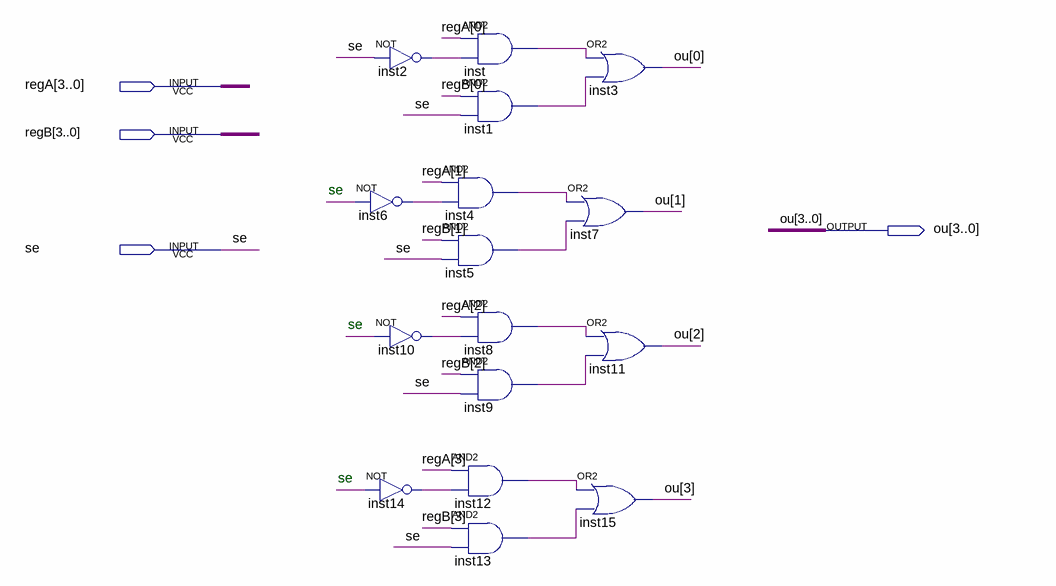
[diagram p0: schematic sheet]
// Quartus schematic mux2.bdf as structural Verilog: 16 symbols, 4 pins
module mux2 (
  input  [3:0] regA,
  input  [3:0] regB,
  input  se,
  output [3:0] ou
);

  wire inst1_out, inst2_out, inst4_out, inst5_out, inst6_out, inst8_out, inst9_out, inst10_out, inst12_out,
       inst13_out, inst14_out, inst_out;

  not inst2 (inst2_out, se);
  not inst6 (inst6_out, se);
  not inst10 (inst10_out, se);
  not inst14 (inst14_out, se);
  and inst (inst_out, regA[0], inst2_out);
  and inst1 (inst1_out, regB[0], se);
  and inst4 (inst4_out, regA[1], inst6_out);
  and inst5 (inst5_out, regB[1], se);
  and inst8 (inst8_out, regA[2], inst10_out);
  and inst9 (inst9_out, regB[2], se);
  and inst12 (inst12_out, regA[3], inst14_out);
  and inst13 (inst13_out, regB[3], se);
  or inst3 (ou[0], inst_out, inst1_out);
  or inst7 (ou[1], inst4_out, inst5_out);
  or inst11 (ou[2], inst8_out, inst9_out);
  or inst15 (ou[3], inst12_out, inst13_out);

  // Notes on the sheet:
  //   se
  //   se
  //   se
endmodule
